# Altium schematic sheet MPU IOs.SchDoc: MPU I/Os
size A3; CheckedBy: NA; DrawnBy: Deepak Reddy; Revision: 1.0.0; SheetNumber: 3; SheetTotal: 8
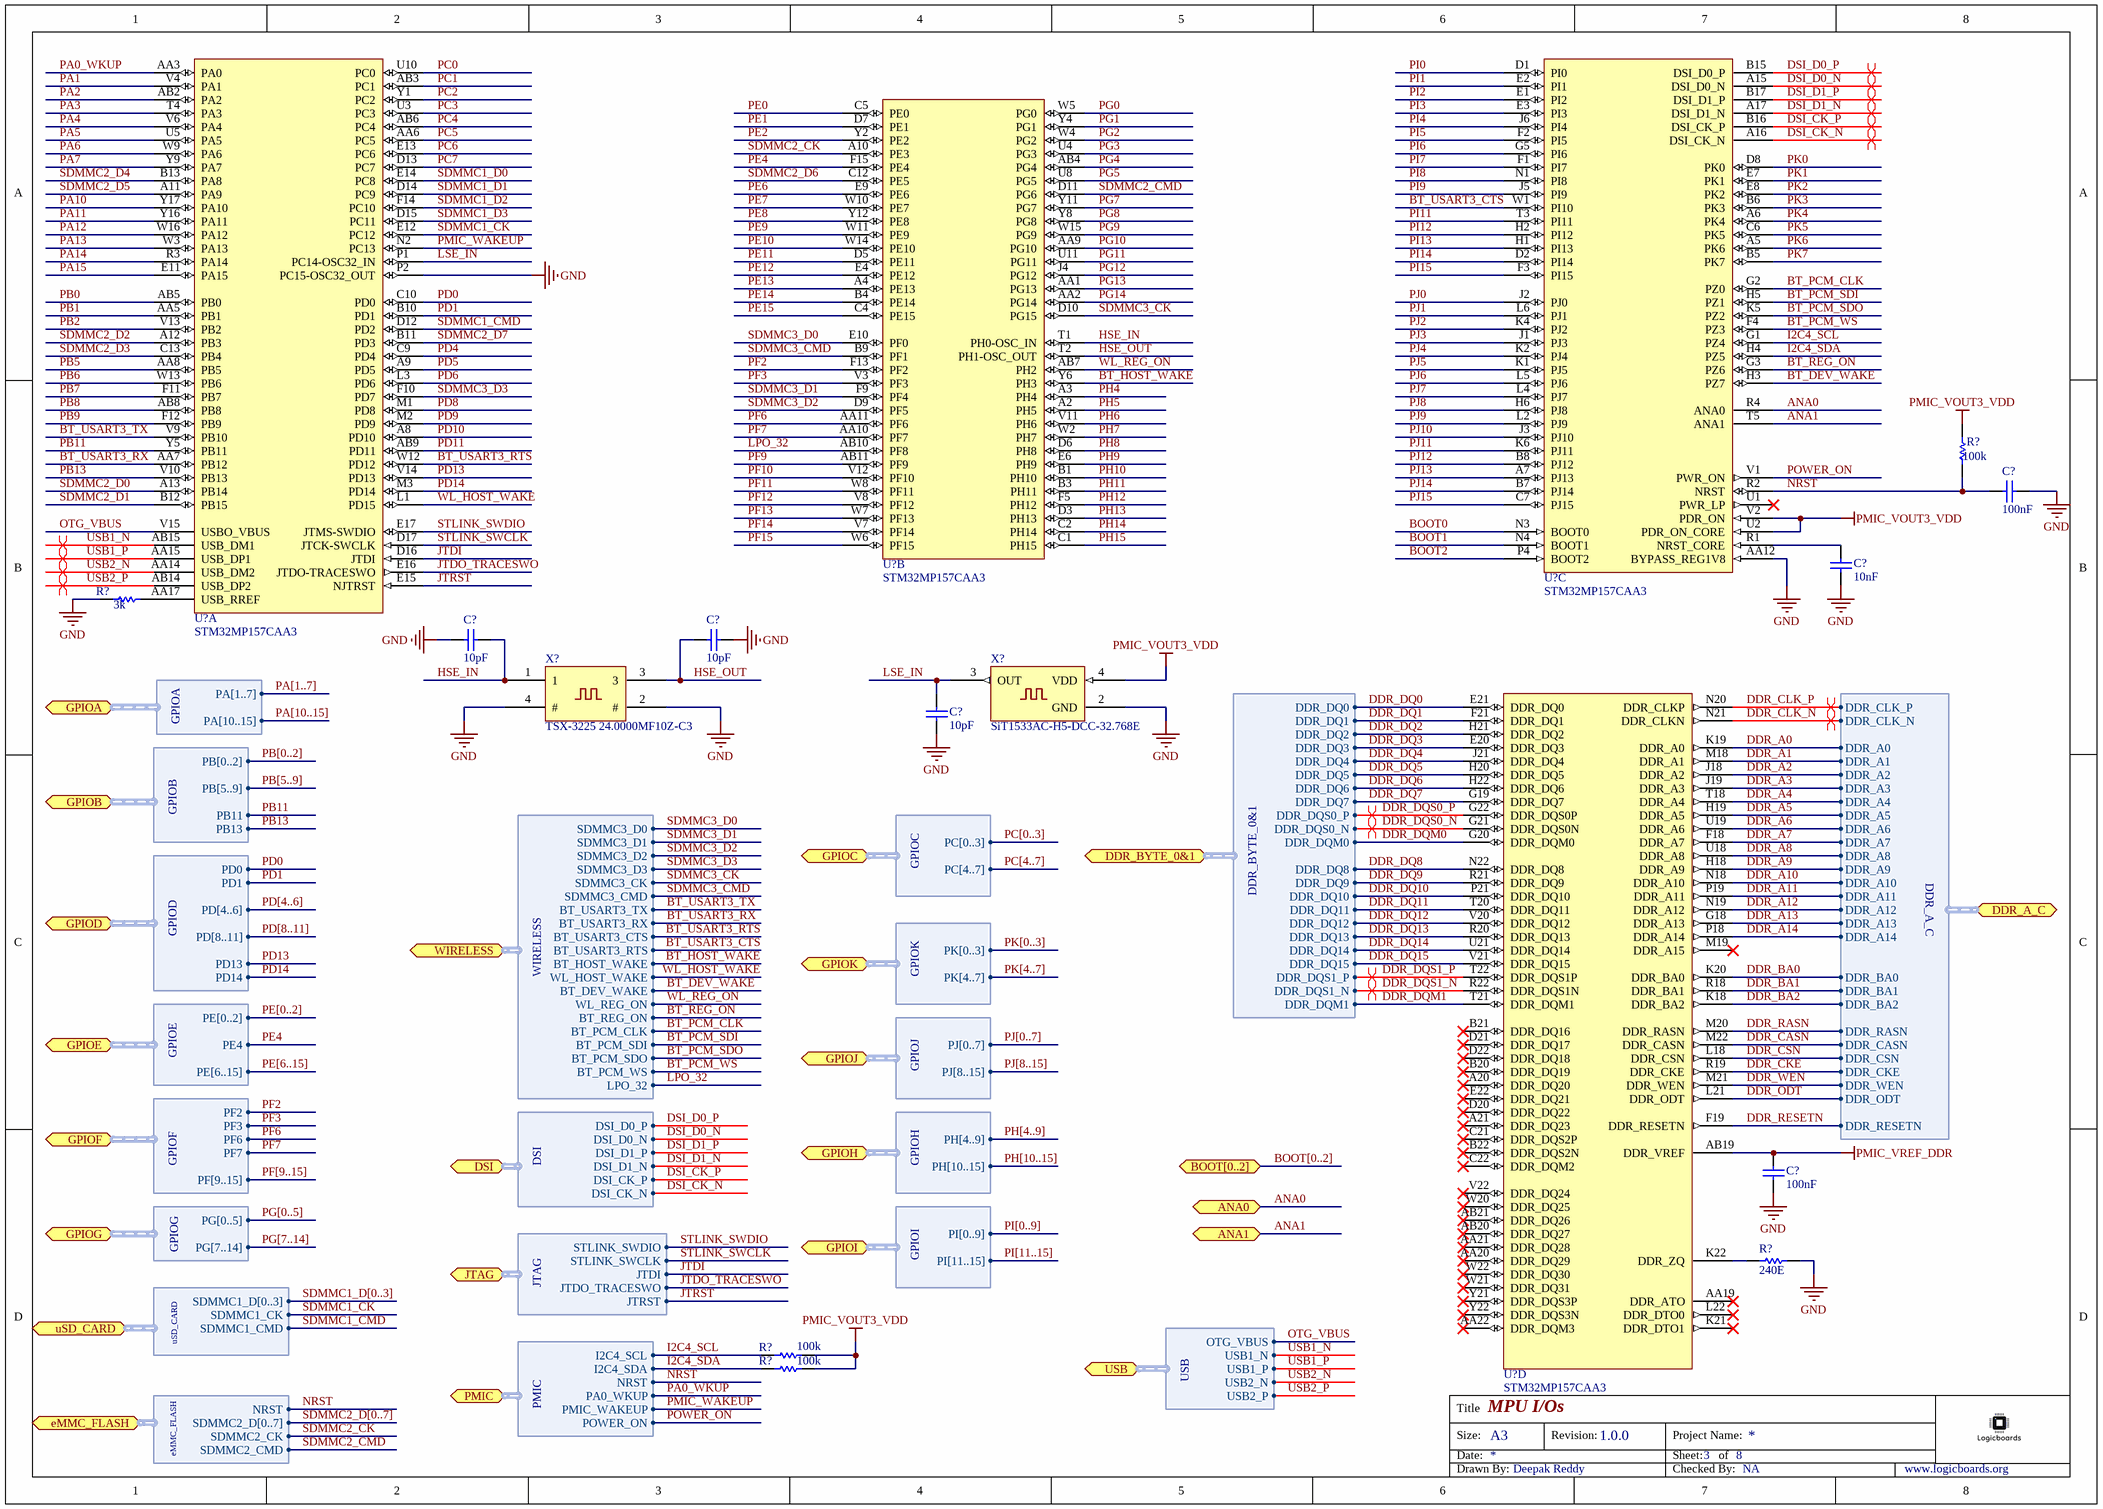
[diagram p0: MPU IOs.SchDoc]

## Parts
(Parts that share a designator on the sheet are numbered #1, #2 ... from top to bottom, then left to right.)
C?#1  100nF
C?#2  10nF
C?#3  10pF
C?#4  10pF
C?#5  10pF
C?#6  100nF
R?#1  100k
R?#2  3k
R?#3  240E
R?#4  100k
R?#5  100k
U?#1  STM32MP157CAA3  (part C of 6)
U?#2  STM32MP157CAA3  (part B of 6)
U?#3  STM32MP157CAA3  (part A of 6)
U?#4  STM32MP157CAA3  (part D of 6)
X?#1  TSX-3225 24.0000MF10Z-C3
X?#2  SiT1533AC-H5-DCC-32.768E

## Ports
ANA0 (bidir), ANA1 (bidir), BOOT[0..2] (bidir), DDR_A_C (bidir, harness DDR_A_C), DDR_BYTE_0&1 (bidir, harness DDR_BYTE_0&1), DSI (bidir, harness DSI), eMMC_FLASH (bidir, harness eMMC_FLASH), GPIOA (bidir, harness GPIOA), GPIOB (bidir, harness GPIOB), GPIOC (bidir, harness GPIOC), GPIOD (bidir, harness GPIOD), GPIOE (bidir, harness GPIOE), GPIOF (bidir, harness GPIOF), GPIOG (bidir, harness GPIOG), GPIOH (bidir, harness GPIOH), GPIOI (bidir, harness GPIOI), GPIOJ (bidir, harness GPIOJ), GPIOK (bidir, harness GPIOK), JTAG (bidir, harness JTAG), PMIC (bidir, harness PMIC), USB (bidir, harness USB), uSD_CARD (bidir, harness uSD_CARD), WIRELESS (bidir, harness WIRELESS)

## Harnesses
DDR_BYTE_0&1: DDR_DQ0, DDR_DQ1, DDR_DQ2, DDR_DQ3, DDR_DQ4, DDR_DQ5, DDR_DQ6, DDR_DQ7, DDR_DQS0_P, DDR_DQS0_N, DDR_DQM0, DDR_DQ8, DDR_DQ9, DDR_DQ10, DDR_DQ11, DDR_DQ12, DDR_DQ13, DDR_DQ14, DDR_DQ15, DDR_DQS1_P, DDR_DQS1_N, DDR_DQM1
DDR_A_C: DDR_CLK_P, DDR_CLK_N, DDR_A0, DDR_A1, DDR_A2, DDR_A3, DDR_A4, DDR_A5, DDR_A6, DDR_A7, DDR_A8, DDR_A9, DDR_A10, DDR_A11, DDR_A12, DDR_A13, DDR_A14, DDR_BA0, DDR_BA1, DDR_BA2, DDR_RASN, DDR_CASN, DDR_CSN, DDR_CKE, DDR_WEN, DDR_ODT, DDR_RESETN
GPIOF: PF2, PF3, PF6, PF7, PF[9..15]
uSD_CARD: SDMMC1_CK, SDMMC1_CMD, SDMMC1_D[0..3]
eMMC_FLASH: SDMMC2_D[0..7], SDMMC2_CK, SDMMC2_CMD, NRST
WIRELESS: SDMMC3_D0, SDMMC3_D1, SDMMC3_D2, SDMMC3_D3, SDMMC3_CK, SDMMC3_CMD, BT_USART3_TX, BT_USART3_RX, BT_USART3_CTS, BT_USART3_RTS, BT_HOST_WAKE, WL_HOST_WAKE, BT_DEV_WAKE, WL_REG_ON, BT_REG_ON, BT_PCM_CLK, BT_PCM_SDI, BT_PCM_SDO, BT_PCM_WS, LPO_32
GPIOA: PA[1..7], PA[10..15]
GPIOB: PB[0..2], PB[5..9], PB11, PB13
GPIOD: PD0, PD1, PD[4..6], PD[8..11], PD13, PD14
GPIOE: PE[0..2], PE4, PE[6..15]
GPIOG: PG[0..5], PG[7..14]
DSI: DSI_D0_P, DSI_D0_N, DSI_D1_P, DSI_D1_N, DSI_CK_P, DSI_CK_N
JTAG: STLINK_SWDIO, STLINK_SWCLK, JTDI, JTDO_TRACESWO, JTRST
PMIC: I2C4_SCL, I2C4_SDA, NRST, PA0_WKUP, PMIC_WAKEUP, POWER_ON
USB: OTG_VBUS, USB1_N, USB1_P, USB2_N, USB2_P
GPIOK: PK[0..3], PK[4..7]
GPIOJ: PJ[0..7], PJ[8..15]
GPIOH: PH[4..9], PH[10..15]
GPIOI: PI[0..9], PI[11..15]
GPIOC: PC[0..3], PC[4..7]

## Nets
GND: C?#1.1 C?#2.2 C?#3.1 C?#4.2 C?#5.2 C?#6.2 R?#2.2 R?#3.2 U?#1.AA12(BYPASS_REG1V8) U?#3.P2(PC15-OSC32_OUT) X?#1.2(#) X?#1.4(#) X?#2.2(GND)
PMIC_VOUT3_VDD: R?#1.2 R?#4.2 R?#5.2 U?#1.U2(PDR_ON_CORE) U?#1.V2(PDR_ON) X?#2.4(VDD)
PMIC_VREF_DDR: C?#6.1 U?#4.AB19(DDR_VREF)
ANA0: U?#1.R4(ANA0) ; port ANA0
ANA1: U?#1.T5(ANA1) ; port ANA1
BOOT0: U?#1.N3(BOOT0)
BOOT1: U?#1.N4(BOOT1)
BOOT2: U?#1.P4(BOOT2)
BT_DEV_WAKE: U?#1.H3(PZ7) ; port WIRELESS.BT_DEV_WAKE
BT_HOST_WAKE: U?#2.Y6(PH3) ; port WIRELESS.BT_HOST_WAKE
BT_PCM_CLK: U?#1.G2(PZ0) ; port WIRELESS.BT_PCM_CLK
BT_PCM_SDI: U?#1.H5(PZ1) ; port WIRELESS.BT_PCM_SDI
BT_PCM_SDO: U?#1.K5(PZ2) ; port WIRELESS.BT_PCM_SDO
BT_PCM_WS: U?#1.F4(PZ3) ; port WIRELESS.BT_PCM_WS
BT_REG_ON: U?#1.G3(PZ6) ; port WIRELESS.BT_REG_ON
BT_USART3_CTS: U?#1.W1(PI10) ; port WIRELESS.BT_USART3_RTS
BT_USART3_RTS: U?#3.W12(PD12) ; port WIRELESS.BT_USART3_CTS
BT_USART3_RX: U?#3.AA7(PB12) ; port WIRELESS.BT_USART3_RX
BT_USART3_TX: U?#3.V9(PB10) ; port WIRELESS.BT_USART3_TX
DDR_A0: U?#4.K19(DDR_A0) ; port DDR_A_C.DDR_A0
DDR_A1: U?#4.M18(DDR_A1) ; port DDR_A_C.DDR_A1
DDR_A2: U?#4.J18(DDR_A2) ; port DDR_A_C.DDR_A2
DDR_A3: U?#4.J19(DDR_A3) ; port DDR_A_C.DDR_A3
DDR_A4: U?#4.T18(DDR_A4) ; port DDR_A_C.DDR_A4
DDR_A5: U?#4.H19(DDR_A5) ; port DDR_A_C.DDR_A5
DDR_A6: U?#4.U19(DDR_A6) ; port DDR_A_C.DDR_A6
DDR_A7: U?#4.F18(DDR_A7) ; port DDR_A_C.DDR_A7
DDR_A8: U?#4.U18(DDR_A8) ; port DDR_A_C.DDR_A8
DDR_A9: U?#4.H18(DDR_A9) ; port DDR_A_C.DDR_A9
DDR_A10: U?#4.N18(DDR_A10) ; port DDR_A_C.DDR_A10
DDR_A11: U?#4.P19(DDR_A11) ; port DDR_A_C.DDR_A11
DDR_A12: U?#4.N19(DDR_A12) ; port DDR_A_C.DDR_A12
DDR_A13: U?#4.G18(DDR_A13) ; port DDR_A_C.DDR_A13
DDR_A14: U?#4.P18(DDR_A14) ; port DDR_A_C.DDR_A14
DDR_BA0: U?#4.K20(DDR_BA0) ; port DDR_A_C.DDR_BA0
DDR_BA1: U?#4.R18(DDR_BA1) ; port DDR_A_C.DDR_BA1
DDR_BA2: U?#4.K18(DDR_BA2) ; port DDR_A_C.DDR_BA2
DDR_CASN: U?#4.M22(DDR_CASN) ; port DDR_A_C.DDR_CASN
DDR_CKE: U?#4.R19(DDR_CKE) ; port DDR_A_C.DDR_CKE
DDR_CLK_N: U?#4.N21(DDR_CLKN) ; port DDR_A_C.DDR_CLK_N
DDR_CLK_P: U?#4.N20(DDR_CLKP) ; port DDR_A_C.DDR_CLK_P
DDR_CSN: U?#4.L18(DDR_CSN) ; port DDR_A_C.DDR_CSN
DDR_DQ0: U?#4.E21(DDR_DQ0) ; port DDR_BYTE_0&1.DDR_DQ0
DDR_DQ1: U?#4.F21(DDR_DQ1) ; port DDR_BYTE_0&1.DDR_DQ1
DDR_DQ2: U?#4.H21(DDR_DQ2) ; port DDR_BYTE_0&1.DDR_DQ2
DDR_DQ3: U?#4.E20(DDR_DQ3) ; port DDR_BYTE_0&1.DDR_DQ3
DDR_DQ4: U?#4.J21(DDR_DQ4) ; port DDR_BYTE_0&1.DDR_DQ4
DDR_DQ5: U?#4.H20(DDR_DQ5) ; port DDR_BYTE_0&1.DDR_DQ5
DDR_DQ6: U?#4.H22(DDR_DQ6) ; port DDR_BYTE_0&1.DDR_DQ6
DDR_DQ7: U?#4.G19(DDR_DQ7) ; port DDR_BYTE_0&1.DDR_DQ7
DDR_DQ8: U?#4.N22(DDR_DQ8) ; port DDR_BYTE_0&1.DDR_DQ8
DDR_DQ9: U?#4.R21(DDR_DQ9) ; port DDR_BYTE_0&1.DDR_DQ9
DDR_DQ10: U?#4.P21(DDR_DQ10) ; port DDR_BYTE_0&1.DDR_DQ10
DDR_DQ11: U?#4.T20(DDR_DQ11) ; port DDR_BYTE_0&1.DDR_DQ11
DDR_DQ12: U?#4.V20(DDR_DQ12) ; port DDR_BYTE_0&1.DDR_DQ12
DDR_DQ13: U?#4.R20(DDR_DQ13) ; port DDR_BYTE_0&1.DDR_DQ13
DDR_DQ14: U?#4.U21(DDR_DQ14) ; port DDR_BYTE_0&1.DDR_DQ14
DDR_DQ15: U?#4.V21(DDR_DQ15) ; port DDR_BYTE_0&1.DDR_DQ15
DDR_DQM0: U?#4.G20(DDR_DQM0) ; port DDR_BYTE_0&1.DDR_DQM0
DDR_DQM1: U?#4.T21(DDR_DQM1) ; port DDR_BYTE_0&1.DDR_DQM1
DDR_DQS0_N: U?#4.G21(DDR_DQS0N) ; port DDR_BYTE_0&1.DDR_DQS0_N
DDR_DQS0_P: U?#4.G22(DDR_DQS0P) ; port DDR_BYTE_0&1.DDR_DQS0_P
DDR_DQS1_N: U?#4.R22(DDR_DQS1N) ; port DDR_BYTE_0&1.DDR_DQS1_N
DDR_DQS1_P: U?#4.T22(DDR_DQS1P) ; port DDR_BYTE_0&1.DDR_DQS1_P
DDR_ODT: U?#4.L21(DDR_ODT) ; port DDR_A_C.DDR_ODT
DDR_RASN: U?#4.M20(DDR_RASN) ; port DDR_A_C.DDR_RASN
DDR_RESETN: U?#4.F19(DDR_RESETN) ; port DDR_A_C.DDR_RESETN
DDR_WEN: U?#4.M21(DDR_WEN) ; port DDR_A_C.DDR_WEN
DSI_CK_N: U?#1.A16(DSI_CK_N) ; port DSI.DSI_CK_N
DSI_CK_P: U?#1.B16(DSI_CK_P) ; port DSI.DSI_CK_P
DSI_D0_N: U?#1.A15(DSI_D0_N) ; port DSI.DSI_D0_N
DSI_D0_P: U?#1.B15(DSI_D0_P) ; port DSI.DSI_D0_P
DSI_D1_N: U?#1.A17(DSI_D1_N) ; port DSI.DSI_D1_N
DSI_D1_P: U?#1.B17(DSI_D1_P) ; port DSI.DSI_D1_P
HSE_IN: C?#3.2 U?#2.T1(PH0-OSC_IN) X?#1.1
HSE_OUT: C?#4.1 U?#2.T2(PH1-OSC_OUT) X?#1.3
I2C4_SCL: R?#4.1 U?#1.G1(PZ4) ; port PMIC.I2C4_SCL
I2C4_SDA: R?#5.1 U?#1.H4(PZ5) ; port PMIC.I2C4_SDA
JTDI: U?#3.D16(JTDI) ; port JTAG.JTDI
JTDO_TRACESWO: U?#3.E16(JTDO-TRACESWO) ; port JTAG.JTDO_TRACESWO
JTRST: U?#3.E15(NJTRST) ; port JTAG.JTRST
LPO_32: U?#2.AB10(PF8) ; port WIRELESS.LPO_32
LSE_IN: C?#5.1 U?#3.P1(PC14-OSC32_IN) X?#2.3(OUT)
NRST: C?#1.2 R?#1.1 U?#1.R2(NRST) ; port eMMC_FLASH.NRST, port PMIC.NRST
OTG_VBUS: U?#3.V15(USBO_VBUS) ; port USB.OTG_VBUS
PA0_WKUP: U?#3.AA3(PA0) ; port PMIC.PA0_WKUP
PA1: U?#3.V4(PA1)
PA2: U?#3.AB2(PA2)
PA3: U?#3.T4(PA3)
PA4: U?#3.V6(PA4)
PA5: U?#3.U5(PA5)
PA6: U?#3.W9(PA6)
PA7: U?#3.Y9(PA7)
PA10: U?#3.Y17(PA10)
PA11: U?#3.Y16(PA11)
PA12: U?#3.W16(PA12)
PA13: U?#3.W3(PA13)
PA14: U?#3.R3(PA14)
PA15: U?#3.E11(PA15)
PB0: U?#3.AB5(PB0)
PB1: U?#3.AA5(PB1)
PB2: U?#3.V13(PB2)
PB5: U?#3.AA8(PB5)
PB6: U?#3.W13(PB6)
PB7: U?#3.F11(PB7)
PB8: U?#3.AB8(PB8)
PB9: U?#3.F12(PB9)
PB11: U?#3.Y5(PB11) ; port GPIOB.PB11
PB13: U?#3.V10(PB13) ; port GPIOB.PB13
PC0: U?#3.U10(PC0)
PC1: U?#3.AB3(PC1)
PC2: U?#3.Y1(PC2)
PC3: U?#3.U3(PC3)
PC4: U?#3.AB6(PC4)
PC5: U?#3.AA6(PC5)
PC6: U?#3.E13(PC6)
PC7: U?#3.D13(PC7)
PD0: U?#3.C10(PD0) ; port GPIOD.PD0
PD1: U?#3.B10(PD1) ; port GPIOD.PD1
PD4: U?#3.C9(PD4)
PD5: U?#3.A9(PD5)
PD6: U?#3.L3(PD6)
PD8: U?#3.M1(PD8)
PD9: U?#3.M2(PD9)
PD10: U?#3.A8(PD10)
PD11: U?#3.AB9(PD11)
PD13: U?#3.V14(PD13) ; port GPIOD.PD13
PD14: U?#3.M3(PD14) ; port GPIOD.PD14
PE0: U?#2.C5(PE0)
PE1: U?#2.D7(PE1)
PE2: U?#2.Y2(PE2)
PE4: U?#2.F15(PE4) ; port GPIOE.PE4
PE6: U?#2.E9(PE6)
PE7: U?#2.W10(PE7)
PE8: U?#2.Y12(PE8)
PE9: U?#2.W11(PE9)
PE10: U?#2.W14(PE10)
PE11: U?#2.D5(PE11)
PE12: U?#2.E4(PE12)
PE13: U?#2.A4(PE13)
PE14: U?#2.B4(PE14)
PE15: U?#2.C4(PE15)
PF2: U?#2.F13(PF2) ; port GPIOF.PF2
PF3: U?#2.V3(PF3) ; port GPIOF.PF3
PF6: U?#2.AA11(PF6) ; port GPIOF.PF6
PF7: U?#2.AA10(PF7) ; port GPIOF.PF7
PF9: U?#2.AB11(PF9)
PF10: U?#2.V12(PF10)
PF11: U?#2.W8(PF11)
PF12: U?#2.V8(PF12)
PF13: U?#2.W7(PF13)
PF14: U?#2.V7(PF14)
PF15: U?#2.W6(PF15)
PG0: U?#2.W5(PG0)
PG1: U?#2.Y4(PG1)
PG2: U?#2.W4(PG2)
PG3: U?#2.U4(PG3)
PG4: U?#2.AB4(PG4)
PG5: U?#2.U8(PG5)
PG7: U?#2.Y11(PG7)
PG8: U?#2.Y8(PG8)
PG9: U?#2.W15(PG9)
PG10: U?#2.AA9(PG10)
PG11: U?#2.U11(PG11)
PG12: U?#2.J4(PG12)
PG13: U?#2.AA1(PG13)
PG14: U?#2.AA2(PG14)
PH4: U?#2.A3(PH4)
PH5: U?#2.A2(PH5)
PH6: U?#2.V11(PH6)
PH7: U?#2.W2(PH7)
PH8: U?#2.D6(PH8)
PH9: U?#2.E6(PH9)
PH10: U?#2.B1(PH10)
PH11: U?#2.B3(PH11)
PH12: U?#2.F5(PH12)
PH13: U?#2.D3(PH13)
PH14: U?#2.C2(PH14)
PH15: U?#2.C1(PH15)
PI0: U?#1.D1(PI0)
PI1: U?#1.E2(PI1)
PI2: U?#1.E1(PI2)
PI3: U?#1.E3(PI3)
PI4: U?#1.J6(PI4)
PI5: U?#1.F2(PI5)
PI6: U?#1.G5(PI6)
PI7: U?#1.F1(PI7)
PI8: U?#1.N1(PI8)
PI9: U?#1.J5(PI9)
PI11: U?#1.T3(PI11)
PI12: U?#1.H2(PI12)
PI13: U?#1.H1(PI13)
PI14: U?#1.D2(PI14)
PI15: U?#1.F3(PI15)
PJ0: U?#1.J2(PJ0)
PJ1: U?#1.L6(PJ1)
PJ2: U?#1.K4(PJ2)
PJ3: U?#1.J1(PJ3)
PJ4: U?#1.K2(PJ4)
PJ5: U?#1.K1(PJ5)
PJ6: U?#1.L5(PJ6)
PJ7: U?#1.L4(PJ7)
PJ8: U?#1.H6(PJ8)
PJ9: U?#1.L2(PJ9)
PJ10: U?#1.J3(PJ10)
PJ11: U?#1.K6(PJ11)
PJ12: U?#1.B8(PJ12)
PJ13: U?#1.A7(PJ13)
PJ14: U?#1.B7(PJ14)
PJ15: U?#1.C7(PJ15)
PK0: U?#1.D8(PK0)
PK1: U?#1.E7(PK1)
PK2: U?#1.E8(PK2)
PK3: U?#1.B6(PK3)
PK4: U?#1.A6(PK4)
PK5: U?#1.C6(PK5)
PK6: U?#1.A5(PK6)
PK7: U?#1.B5(PK7)
PMIC_WAKEUP: U?#3.N2(PC13) ; port PMIC.PMIC_WAKEUP
POWER_ON: U?#1.V1(PWR_ON) ; port PMIC.POWER_ON
SDMMC1_CK: U?#3.E12(PC12) ; port uSD_CARD.SDMMC1_CK
SDMMC1_CMD: U?#3.D12(PD2) ; port uSD_CARD.SDMMC1_CMD
SDMMC1_D0: U?#3.E14(PC8)
SDMMC1_D1: U?#3.D14(PC9)
SDMMC1_D2: U?#3.F14(PC10)
SDMMC1_D3: U?#3.D15(PC11)
SDMMC2_CK: U?#2.A10(PE3) ; port eMMC_FLASH.SDMMC2_CK
SDMMC2_CMD: U?#2.D11(PG6) ; port eMMC_FLASH.SDMMC2_CMD
SDMMC2_D0: U?#3.A13(PB14)
SDMMC2_D1: U?#3.B12(PB15)
SDMMC2_D2: U?#3.A12(PB3)
SDMMC2_D3: U?#3.C13(PB4)
SDMMC2_D4: U?#3.B13(PA8)
SDMMC2_D5: U?#3.A11(PA9)
SDMMC2_D6: U?#2.C12(PE5)
SDMMC2_D7: U?#3.B11(PD3)
SDMMC3_CK: U?#2.D10(PG15) ; port WIRELESS.SDMMC3_CK
SDMMC3_CMD: U?#2.B9(PF1) ; port WIRELESS.SDMMC3_CMD
SDMMC3_D0: U?#2.E10(PF0) ; port WIRELESS.SDMMC3_D0
SDMMC3_D1: U?#2.F9(PF4) ; port WIRELESS.SDMMC3_D1
SDMMC3_D2: U?#2.D9(PF5) ; port WIRELESS.SDMMC3_D2
SDMMC3_D3: U?#3.F10(PD7) ; port WIRELESS.SDMMC3_D3
STLINK_SWCLK: U?#3.D17(JTCK-SWCLK) ; port JTAG.STLINK_SWCLK
STLINK_SWDIO: U?#3.E17(JTMS-SWDIO) ; port JTAG.STLINK_SWDIO
USB1_N: U?#3.AB15(USB_DM1) ; port USB.USB1_N
USB1_P: U?#3.AA15(USB_DP1) ; port USB.USB1_P
USB2_N: U?#3.AA14(USB_DM2) ; port USB.USB2_N
USB2_P: U?#3.AB14(USB_DP2) ; port USB.USB2_P
WL_HOST_WAKE: U?#3.L1(PD15) ; port WIRELESS.WL_HOST_WAKE
WL_REG_ON: U?#2.AB7(PH2) ; port WIRELESS.WL_REG_ON
NetC?#2_1: C?#2.1 U?#1.R1(NRST_CORE)
NetR?#2_1: R?#2.1 U?#3.AA17(USB_RREF)
NetR?#3_1: R?#3.1 U?#4.K22(DDR_ZQ)

Not connected (* = marked no-connect by the designer): U?#1 U1(PWR_LP)*; U?#4 A20(DDR_DQ20)* A21(DDR_DQ23)* AA19(DDR_ATO)* AA20(DDR_DQ29)* AA21(DDR_DQ28)* AA22(DDR_DQM3)* AB20(DDR_DQ27)* AB21(DDR_DQ26)* B20(DDR_DQ19)* B21(DDR_DQ16)* B22(DDR_DQS2N)* C21(DDR_DQS2P)* C22(DDR_DQM2)* D20(DDR_DQ22)* D21(DDR_DQ17)* D22(DDR_DQ18)* E22(DDR_DQ21)* K21(DDR_DTO1)* L22(DDR_DTO0)* M19(DDR_A15)* V22(DDR_DQ24)* W20(DDR_DQ25)* W21(DDR_DQ31)* W22(DDR_DQ30)* Y21(DDR_DQS3P)* Y22(DDR_DQS3N)*; X?#2 1(NC)

## Buses and harness runs
bus BOOT[0..2] = port BOOT[0..2]
bus PA[1..7]
bus PA[10..15]
bus PB[0..2]
bus PB[5..9]
bus PC[0..3]
bus PC[4..7]
bus PD[4..6]
bus PD[8..11]
bus PE[0..2]
bus PE[6..15]
bus PF[9..15]
bus PG[0..5]
bus PG[7..14]
bus PH[4..9]
bus PH[10..15]
bus PI[0..9]
bus PI[11..15]
bus PJ[0..7]
bus PJ[8..15]
bus PK[0..3]
bus PK[4..7]
bus SDMMC1_D[0..3]
bus SDMMC2_D[0..7]

## Layout directives
differential pair: DDR_CLK_N, DDR_CLK_P, DDR_DQS0_N, DDR_DQS0_P, DDR_DQS1_N, DDR_DQS1_P, DSI_CK_N, DSI_CK_P, DSI_D0_N, DSI_D0_P, DSI_D1_N, DSI_D1_P, USB1_N, USB1_P, USB2_N, USB2_P

## Notes on the sheet
- Title
- Size:
- Date:
- A3
- Revision:
- Project Name:
- Sheet:
- of
- Drawn By:
- Checked By:
- www.logicboards.org

## Library data of the parts
C?#1-C?#6 = CAP_SMD: Capacitor MLCC; Tolerance: 10%; Dielectric: X5R; Voltage Rating: 6.3V; Supplier 1: Mouser; Manufacturer 1: *; Manufacturer Part Number 1: *; RoHS: Yes; Mount: Surface Mount; Package: *; Capacitance: *; Length: *; Lead Free: Lead Free; Supplier Part Number 1: *; Supplier 2: Digikey; Supplier Part Number 2: *
  C?#1 C?#6: Value: 100nF
  C?#2: Value: 10nF
  C?#3-C?#5: Value: 10pF
R?#1-R?#5 = RES_SMD: General Purpose Chip Resistor Thick Film; Supplier 1: Mouser; RoHS: Yes; Category: Resistors; RoHS Compliant: Yes; Resistance: *; Supplier 2: Digikey; Supplier Part Number 2: *; Package: *
  R?#1 R?#4 R?#5: Value: 100k
  R?#2: Value: 3k
  R?#3: Value: 240E
U?#1-U?#4 = STM32MP157CAA3: IC MPU with Arm Dual Cortex-A7 650 MHz, Arm Cortex-M4; Manufacturer 1: STMicroelectronics; Supplier 1: Mouser; RoHS: Yes; Category: Microprocessors; Supplier Part Number 1: 511-STM32MP157CAA3; Supplier 2: Digi-Key; Supplier Part Number 2: STM32MP157CAA3-ND; Manufacturer Part Number 1: STM32MP157CAA3; Datasheet: https://www.st.com/resource/en/datasheet/stm32mp157c.pdf
X?#1 = TSX-3225 24.0000MF10Z-C3: CRYSTAL 24.00 MHZ 18PFSMD; Manufacturer 1: Epson; Frequency: 24MHz; Tolerance: 10ppm; Load Capacitance: 18pF; ESR (Equivalent Series Resistance): 40R; Drive Level: 200uW; Supplier 1: Mouser; Manufacturer Part Number 1: TSX-322524.0000MF10Z-C3; RoHS: Yes; Category: Crystals; Pricing 1: 1=0.39000, 10=0.31300, 50=0.31300, 100=0.25200, 1000=0.25200, 10000=0.25200 (USD); Mount: Surface Mount; Case/Package: SMD/SMT; Weight: 0.000564oz; Min Operating Temperature: -20°C; Max Operating Temperature: 75°C; Packaging: Tape and Reel; Package Quantity: 250; Termination: SMD/SMT; Frequency Stability: 10ppm; Frequency Tolerance: 10ppm; Series: TSX-3225; Length: 0.126inch; Width: 2.5mm; Height: 0.024inch; Lead Free: Lead Free; RoHS Compliant: Yes; ComponentLink1URL: https://datasheet.ciiva.com/4946/fa-238-238v-tsx-3225-e09x-4946452.pdf?src-supplier=Mouser; ComponentLink1Description: https://datasheet.ciiva.com/4946/fa-238-238v-tsx-3225-e09x-4946452.pdf?src-supplier=Mouser; Supplier 2: Digi-Key; Supplier Part Number 1: 732-322524MF10Z-C3; Supplier Part Number 2: SER4373DKR-ND
X?#2 = SiT1533AC-H5-DCC-32.768E: Oscillator MEMS 0.032768MHz ±75ppm (Stability) 15pF LVCMOS 52% 1.8V/2.5V/3.3V 4-Pin SMD T/R; Manufacturer 1: SiTime; Frequency: 32.768kHz; Max Supply Current: 1.3uA; Supplier 1: Mouser; Manufacturer Part Number 1: SIT1533AC-H5-DCC-32.768E; RoHS: Yes; Category: Oscillators; Pricing 1: 1=1.13000, 10=1.00000, 50=1.00000, 100=0.82700, 1000=0.59400, 10000=0.59400 (USD); Mount: Surface Mount; Case/Package: SMD/SMT; Number of Pins: 4; Min Operating Temperature: -10°C; Max Operating Temperature: 70°C; Packaging: Tape and Reel; Frequency Stability: 75ppm; Length: 0.079inch; Width: 0.047inch; Height: 0.024inch; RoHS Compliant: Yes; ComponentLink1URL: http://components.arrow.com/part/dataview/0323_07503286?src-supplier=Arrow+Europe; ComponentLink1Description: http://components.arrow.com/part/dataview/0323_07503286?src-supplier=Arrow+Europe; ComponentLink2URL: http://www.sitime.com/products/datasheets/sit1533/SiT1533-datasheet.pdf?src-supplier=Digi-Key; ComponentLink2Description: http://www.sitime.com/products/datasheets/sit1533/SiT1533-datasheet.pdf?src-supplier=Digi-Key; ComponentLink3URL: https://www.sitime.com/datasheet/SiT1533?src-supplier=Digi-Key; ComponentLink3Description: https://www.sitime.com/datasheet/SiT1533?src-supplier=Digi-Key; Supplier 2: Digi-Key; Pricing 2: 1=1.05000, 10=0.92900, 50=0.86860, 100=0.76760, 500=0.72720 (USD); Supplier Part Number 1: 788-1533ACH5DCC32.7E; Supplier Part Number 2: 1473-1516-1-ND; Datasheet: https://www.mouser.in/datasheet/2/371/SiT1533_rev1.4_03202018-1324419.pdf